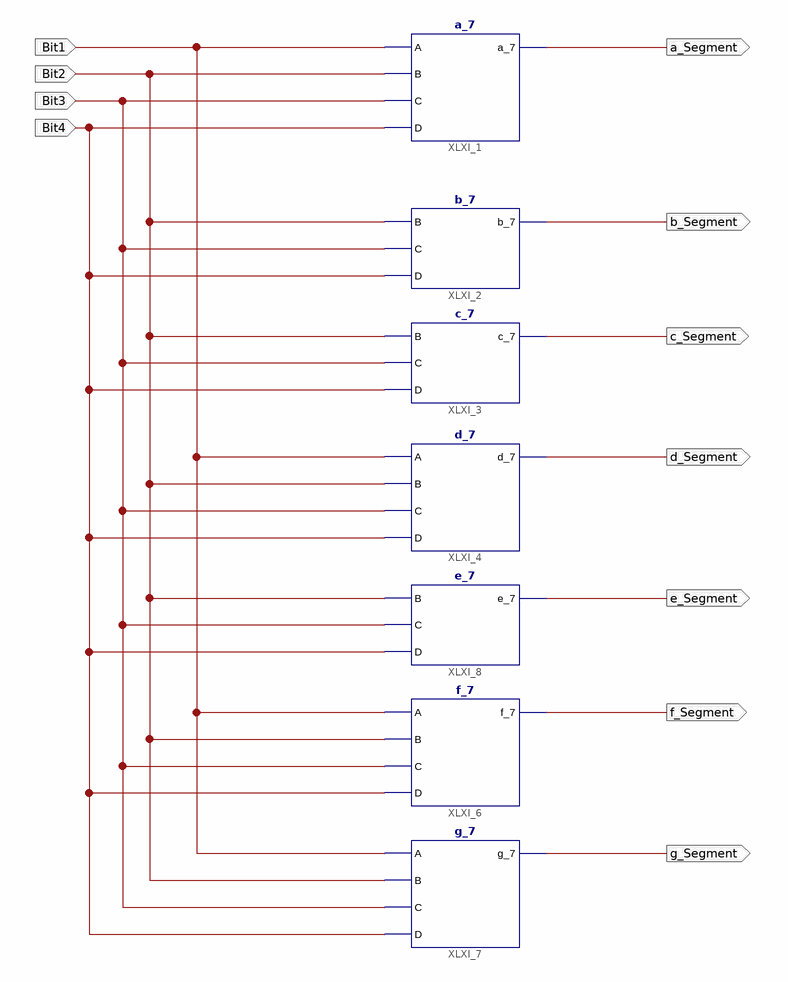
[diagram p0: schematic sheet 1]
// Xilinx ISE schematic BCD.sch (spartan6) as structural Verilog: 7 symbols, 11 ports
module BCD (
  input  Bit1,
  input  Bit2,
  input  Bit3,
  input  Bit4,
  output a_Segment,
  output b_Segment,
  output c_Segment,
  output d_Segment,
  output e_Segment,
  output f_Segment,
  output g_Segment
);

  a_7 XLXI_1 (.A(Bit1), .B(Bit2), .C(Bit3), .D(Bit4), .a_7(a_Segment));
  b_7 XLXI_2 (.C(Bit3), .D(Bit4), .B(Bit2), .b_7(b_Segment));
  c_7 XLXI_3 (.B(Bit2), .C(Bit3), .D(Bit4), .c_7(c_Segment));
  d_7 XLXI_4 (.A(Bit1), .B(Bit2), .C(Bit3), .D(Bit4), .d_7(d_Segment));
  f_7 XLXI_6 (.A(Bit1), .B(Bit2), .C(Bit3), .D(Bit4), .f_7(f_Segment));
  g_7 XLXI_7 (.A(Bit1), .B(Bit2), .C(Bit3), .D(Bit4), .g_7(g_Segment));
  e_7 XLXI_8 (.B(Bit2), .D(Bit4), .C(Bit3), .e_7(e_Segment));
endmodule
